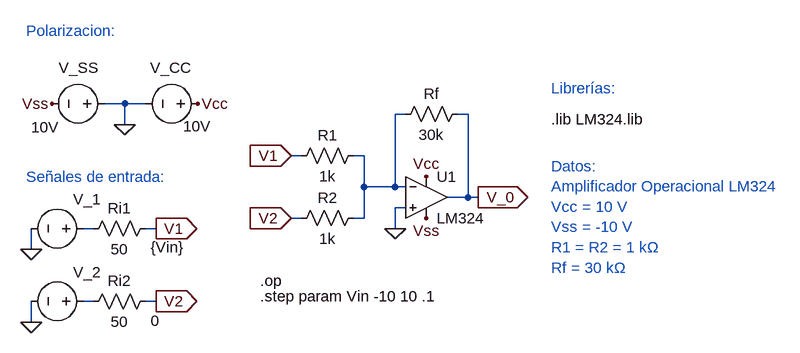
[diagram p0: schematic Lab_2_Circ_1_Ri=50+Vo=f(V1).asc]
Lab_2_Circ_1_Ri=50+Vo=f(V1).asc, the LTspice schematic file:
Version 4
SHEET 1 1560 680
WIRE 32 -256 0 -256
WIRE 64 -256 32 -256
WIRE 464 -240 448 -240
WIRE 560 -240 544 -240
WIRE 32 -224 32 -256
WIRE 304 -176 288 -176
WIRE 400 -176 384 -176
WIRE 400 -128 400 -176
WIRE 448 -128 448 -240
WIRE 448 -128 400 -128
WIRE 464 -128 448 -128
WIRE 560 -112 560 -240
WIRE 560 -112 528 -112
WIRE 576 -112 560 -112
WIRE 464 -96 448 -96
WIRE 304 -80 288 -80
WIRE 400 -80 400 -128
WIRE 400 -80 384 -80
WIRE -16 -64 -32 -64
WIRE 80 -64 64 -64
WIRE 448 -64 448 -96
WIRE -112 -32 -112 -64
WIRE -16 48 -32 48
WIRE 80 48 64 48
WIRE -112 80 -112 48
FLAG 448 -64 0
FLAG 144 -256 Vcc
FLAG 496 -144 Vcc
FLAG -80 -256 Vss
FLAG 496 -80 Vss
FLAG 32 -224 0
FLAG 288 -176 V1
IOPIN 288 -176 In
FLAG 288 -80 V2
IOPIN 288 -80 In
FLAG 576 -112 V_0
IOPIN 576 -112 Out
FLAG -112 -32 0
FLAG 80 -64 V1
IOPIN 80 -64 Out
FLAG -112 80 0
FLAG 80 48 V2
IOPIN 80 48 Out
SYMBOL OpAmps\\opamp2 496 -176 R0
SYMATTR InstName U1
SYMATTR Value LM324
SYMBOL res 288 -160 R270
WINDOW 0 32 56 VTop 2
WINDOW 3 0 56 VBottom 2
SYMATTR InstName R1
SYMATTR Value 1k
SYMBOL res 288 -64 R270
WINDOW 0 32 56 VTop 2
WINDOW 3 0 56 VBottom 2
SYMATTR InstName R2
SYMATTR Value 1k
SYMBOL res 560 -256 R90
WINDOW 0 0 56 VBottom 2
WINDOW 3 32 56 VTop 2
SYMATTR InstName Rf
SYMATTR Value 30k
SYMBOL voltage 160 -256 R90
WINDOW 0 -55 25 VRight 2
WINDOW 3 35 -5 VRight 2
WINDOW 123 0 0 Left 0
WINDOW 39 0 0 Left 0
SYMATTR InstName V_CC
SYMATTR Value 10V
SYMBOL voltage 16 -256 R90
WINDOW 0 -55 25 VRight 2
WINDOW 3 36 85 VRight 2
WINDOW 123 0 0 Left 0
WINDOW 39 0 0 Left 0
SYMATTR InstName V_SS
SYMATTR Value 10V
SYMBOL res -32 -48 R270
WINDOW 0 32 56 VTop 2
WINDOW 3 0 56 VBottom 2
SYMATTR InstName Ri1
SYMATTR Value 50
SYMBOL voltage -16 -64 M270
WINDOW 0 45 31 VLeft 2
WINDOW 3 -29 -88 VLeft 2
WINDOW 123 0 0 Left 0
WINDOW 39 0 0 Left 0
SYMATTR InstName V_1
SYMATTR Value {Vin}
SYMBOL res -32 64 R270
WINDOW 0 32 56 VTop 2
WINDOW 3 0 56 VBottom 2
SYMATTR InstName Ri2
SYMATTR Value 50
SYMBOL voltage -16 48 M270
WINDOW 0 45 31 VLeft 2
WINDOW 3 -30 -88 VLeft 2
WINDOW 123 0 0 Left 0
WINDOW 39 0 0 Left 0
SYMATTR InstName V_2
SYMATTR Value 0
TEXT 688 -232 Left 2 !.lib LM324.lib
TEXT 688 -280 Left 2 ;Librerías:
TEXT -120 -368 Left 2 ;Polarizacion:
TEXT 688 -160 Left 2 ;Datos:\nAmplificador Operacional LM324\nVcc = 10 V\nVss = -10 V\nR1 = R2 = 1 kΩ\nRf = 30 kΩ
TEXT 240 16 Left 2 !.op
TEXT 240 40 Left 2 !.step param Vin -10 10 .1
TEXT -120 -144 Left 2 ;Señales de entrada:

The netlist it stands for:
* Lab_2_Circ_1_Ri=50+Vo=f(V1).asc
XU1 0 N001 Vcc Vss V_0 LM324  ; pins In+ In- V+ V- OUT
R1 V1 N001 1k
R2 V2 N001 1k
Rf V_0 N001 30k
V_CC Vcc 0 10V
V_SS 0 Vss 10V
Ri1 N002 V1 50
V_1 N002 0 {Vin}
Ri2 N003 V2 50
V_2 N003 0 0
.lib LM324.lib
* Librerías:
* Polarizacion:
* Datos:
* Amplificador Operacional LM324
* Vcc = 10 V
* Vss = -10 V
* R1 = R2 = 1 kΩ
* Rf = 30 kΩ
.op
.step param Vin -10 10 .1
* Señales de entrada:
.backanno
.end

* Results of the author's LTspice run, read from the files saved beside the schematic
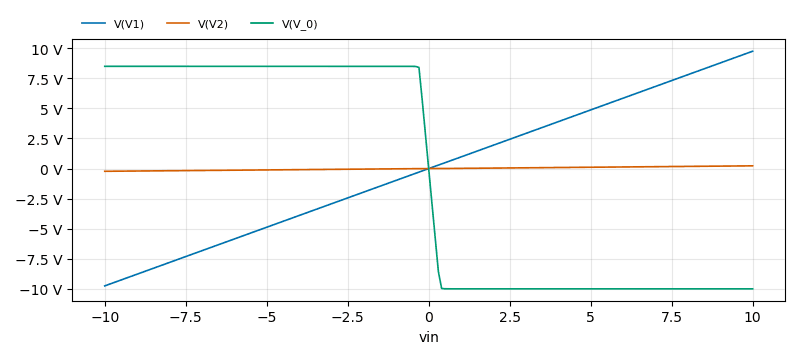
[diagram p1: Operating Point of Lab_2_Circ_1_Ri=50+Vo=f(V1).asc, plotted from the saved traces]
* Operating Point, 1 run:
*   V(V1): -9.751 V at vin=-10 , 9.75 V at vin=10 , min -9.751 V, max 9.75 V
*   V(V2): -227 mV at vin=-10 , 225.8 mV at vin=10 , min -227 mV, max 225.8 mV
*   V(V_0): 8.496 V at vin=-10 , -9.995 V at vin=10 , min -9.995 V, max 8.496 V
* From the log:
*   Semiconductor Device Operating Points:
*                           --- Diodes ---
*   Name:    d:u1:p      d:u1:ln     d:u1:lp     d:u1:e      d:u1:c
*   Model:    u1:dx       u1:dx       u1:dx       u1:dx       u1:dx
*   Id:     -2.00e-11   -4.05e-11   -3.96e-11   -1.79e-11    8.14e-06
*   Vd:     -2.00e+01   -4.05e+01   -3.95e+01   -1.79e+01    5.96e-01
*   Req:     1.00e+12    1.00e+12    1.00e+12    1.00e+12    3.18e+03
*   CAP:     0.00e+00    0.00e+00    0.00e+00    0.00e+00    0.00e+00
*                           --- Bipolar Transistors ---
*   Name:     q:u1:2      q:u1:1
*   Model:     u1:qx       u1:qx
*   Ib:       1.41e-11   -4.08e-08
*   Ic:      -1.00e-11   -1.02e-05
*   Vbe:      4.14e+00   -6.02e-01
*   Vbc:      1.00e+01    5.15e+00
*   Vce:     -5.86e+00   -5.75e+00
*   BetaDC:  -7.07e-01    2.50e+02
*   Gm:       1.04e-83    3.95e-04
*   Rpi:      1.00e+12    6.34e+05
*   Rx:       0.00e+00    0.00e+00
*   Ro:       0.00e+00    0.00e+00
*   Cbe:      0.00e+00    0.00e+00
*   Cbc:      0.00e+00    0.00e+00
*   Cjs:      0.00e+00    0.00e+00
*   BetaAC:   1.04e-71    2.50e+02
*   Cbx:      0.00e+00    0.00e+00
*   Ft:       0.00e+00    0.00e+00